# Altium project PCB_Project1.PrjPCB
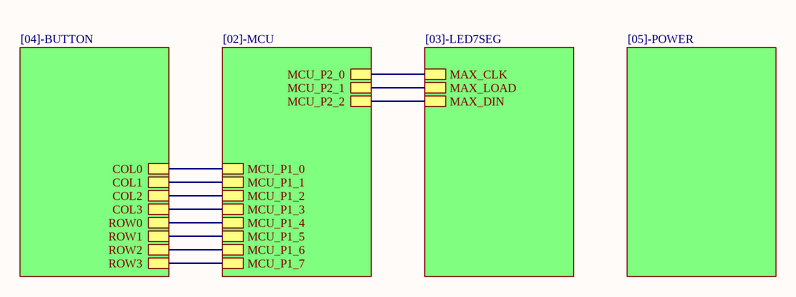
[diagram p0: Sheet1.SchDoc]
5 sheets, 31 parts. Net scope: hierarchical (ports join the sheet entries above them; power ports are global).
Board file: PCB1.PcbDoc
Sheets:
  Sheet1.SchDoc
     = [02]-MCU.SchDoc
    Designator = [04]-BUTTON.SchDoc
     = [05]-POWER.SchDoc
     = [03]-LED7SEG.SchDoc

## Sheet Sheet1.SchDoc
size A; Address1: chien nguyen

### Sub-sheets
Designator = [04]-BUTTON: ROW3, COL2, ROW0, ROW1, COL1, COL0, COL3, ROW2
? = [02]-MCU: MCU_P2_0, MCU_P2_1, MCU_P2_2, MCU_P1_0, MCU_P1_6, MCU_P1_7, MCU_P1_4, MCU_P1_5, MCU_P1_3, MCU_P1_2, MCU_P1_1
? = [05]-POWER: no entries
? = [03]-LED7SEG: MAX_CLK, MAX_DIN, MAX_LOAD

### Nets
NetIC1_1: sheet /MCU_P1_0, sheet Designator/COL0
NetIC1_2: sheet /MCU_P1_1, sheet Designator/COL1
NetIC1_3: sheet /MCU_P1_2, sheet Designator/COL2
NetIC1_4: sheet /MCU_P1_3, sheet Designator/COL3
NetIC1_5: sheet /MCU_P1_4, sheet Designator/ROW0
NetIC1_6: sheet /MCU_P1_5, sheet Designator/ROW1
NetIC1_7: sheet /MCU_P1_6, sheet Designator/ROW2
NetIC1_8: sheet /MCU_P1_7, sheet Designator/ROW3
NetIC1_21: sheet /MCU_P2_0, sheet /MAX_CLK
NetIC1_22: sheet /MCU_P2_1, sheet /MAX_LOAD
NetIC1_23: sheet /MCU_P2_2, sheet /MAX_DIN

## Sheet [02]-MCU.SchDoc
size A
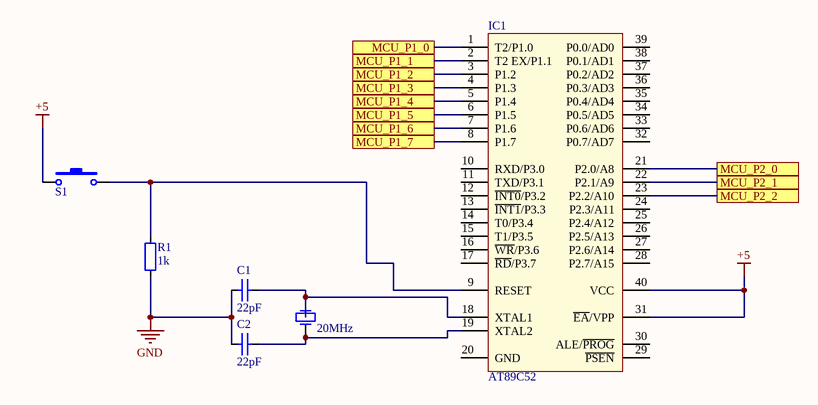
[diagram p1: [02]-MCU.SchDoc]

### Parts
C1  22pF  [CAP_0805]
C2  22pF  [CAP_0805]
IC1  AT89C52  [DIP40/W0.6]
R1  1k  [RES-SMD-0805]
S1  SW-SMD  [SW-SMD]  (value not drawn)
Y1  20MHz  [XTAL]

### Ports
MCU_P1_0, MCU_P1_1, MCU_P1_2, MCU_P1_3, MCU_P1_4, MCU_P1_5, MCU_P1_6, MCU_P1_7, MCU_P2_0, MCU_P2_1, MCU_P2_2

### Nets
+5: IC1.31(~{EA}/VPP) IC1.40(VCC) S1.1
GND: C1.1 C2.1 R1.1
NetC1_2: C1.2 IC1.18(XTAL1) Y1.2(OSC2)
NetC2_2: C2.2 IC1.19(XTAL2) Y1.1(OSC1)
NetIC1_1: IC1.1(T2/P1.0) ; port MCU_P1_0
NetIC1_2: IC1.2(T2_EX/P1.1) ; port MCU_P1_1
NetIC1_3: IC1.3(P1.2) ; port MCU_P1_2
NetIC1_4: IC1.4(P1.3) ; port MCU_P1_3
NetIC1_5: IC1.5(P1.4) ; port MCU_P1_4
NetIC1_6: IC1.6(P1.5) ; port MCU_P1_5
NetIC1_7: IC1.7(P1.6) ; port MCU_P1_6
NetIC1_8: IC1.8(P1.7) ; port MCU_P1_7
NetIC1_9: IC1.9(RESET) R1.2 S1.2
NetIC1_21: IC1.21(P2.0/A8) ; port MCU_P2_0
NetIC1_22: IC1.22(P2.1/A9) ; port MCU_P2_1
NetIC1_23: IC1.23(P2.2/A10) ; port MCU_P2_2

Not connected (* = marked no-connect by the designer): IC1 10(RXD/P3.0) 11(TXD/P3.1) 12(~{INT0}/P3.2) 13(~{INT1}/P3.3) 14(T0/P3.4) 15(T1/P3.5) 16(~{WR}/P3.6) 17(~{RD}/P3.7) 20(GND) 24(P2.3/A11) 25(P2.4/A12) 26(P2.5/A13) 27(P2.6/A14) 28(P2.7/A15) 29(~{PSEN}) 30(ALE/~{PROG}) 32(P0.7/AD7) 33(P0.6/AD6) 34(P0.5/AD5) 35(P0.4/AD4) 36(P0.3/AD3) 37(P0.2/AD2) 38(P0.1/AD1) 39(P0.0/AD0)

### Library data of the parts
C1 C2 = CapSMD: Capacitor; Value: 33p; Published: 8-Jun-2000; LatestRevisionDate: 17-Jul-2002; LatestRevisionNote: Re-released for DXP Platform.; PackageReference: RAD-0.3; Publisher: Altium Limited
IC1 = AT89C52: Atmel AT89C52, 8k Byte Flash Memory , 40 Pin; Value: AT89C52
R1 = Resistor - DIP: Value: R1/4W - 1K
S1 = SW-SMD: Switch; Published: 24-Mar-1999; LatestRevisionDate: 17-Jul-2002; LatestRevisionNote: Re-released for DXP Platform.; PackageReference: SPST-2; Publisher: Altium Limited
Y1 = XTAL: Crystal Oscillator; Published: 8-Jun-2000; LatestRevisionDate: 17-Jul-2002; LatestRevisionNote: Re-released for DXP Platform.; PackageReference: R38; Publisher: Altium Limited

## Sheet [04]-BUTTON.SchDoc
size A
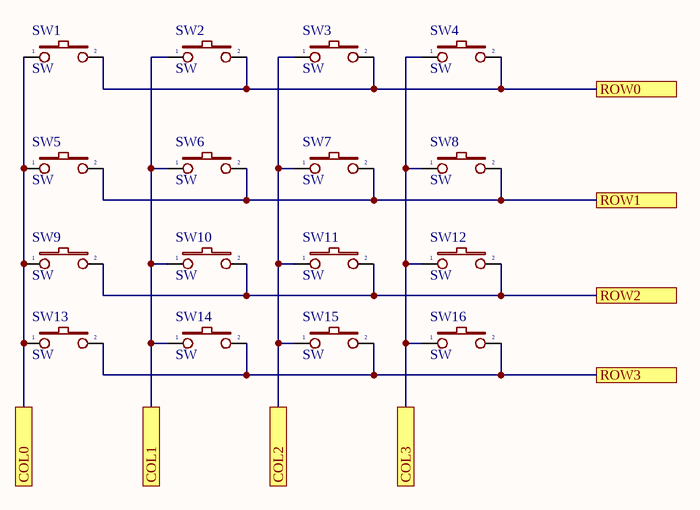
[diagram p2: [04]-BUTTON.SchDoc]

### Parts
SW1  SW  [SW-SMD]
SW2  SW  [SW-SMD]
SW3  SW  [SW-SMD]
SW4  SW  [SW-SMD]
SW5  SW  [SW-SMD]
SW6  SW  [SW-SMD]
SW7  SW  [SW-SMD]
SW8  SW  [SW-SMD]
SW9  SW  [SW-SMD]
SW10  SW  [SW-SMD]
SW11  SW  [SW-SMD]
SW12  SW  [SW-SMD]
SW13  SW  [SW-SMD]
SW14  SW  [SW-SMD]
SW15  SW  [SW-SMD]
SW16  SW  [SW-SMD]

### Ports
COL0, COL1, COL2, COL3, ROW0, ROW1, ROW2, ROW3

### Nets
NetIC1_1: SW1.1 SW5.1 SW9.1 SW13.1 ; port COL0
NetIC1_2: SW2.1 SW6.1 SW10.1 SW14.1 ; port COL1
NetIC1_3: SW3.1 SW7.1 SW11.1 SW15.1 ; port COL2
NetIC1_4: SW4.1 SW8.1 SW12.1 SW16.1 ; port COL3
NetIC1_5: SW1.2 SW2.2 SW3.2 SW4.2 ; port ROW0
NetIC1_6: SW5.2 SW6.2 SW7.2 SW8.2 ; port ROW1
NetIC1_7: SW9.2 SW10.2 SW11.2 SW12.2 ; port ROW2
NetIC1_8: SW13.2 SW14.2 SW15.2 SW16.2 ; port ROW3

### Library data of the parts
SW1-SW16 = SW2: Switch button 2 pin; Value: SW chip 2 pin

## Sheet [05]-POWER.SchDoc
size A
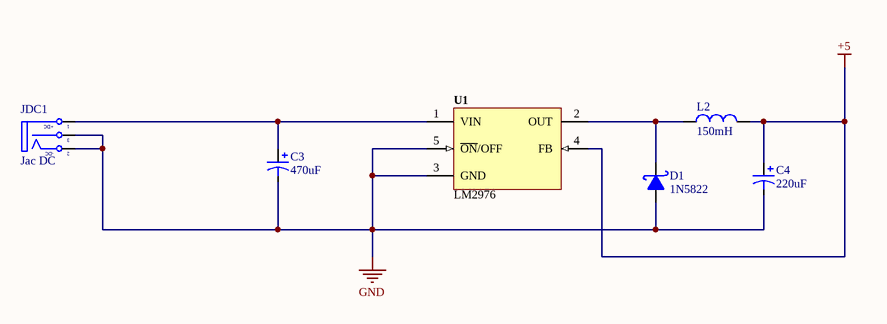
[diagram p3: [05]-POWER.SchDoc]

### Parts
C3  470uF  [C5mm]
C4  220uF  [C5mm]
D1  1N5822  [SMA]
JDC1  Jac DC  [DC-IN]
L2  150mH  [L-SMD-M-7.3x4.5]
U1  LM2976  [TO-263]

### Nets
+5: C4.1 L2.2 U1.4(FB)
GND: C3.2 C4.2 D1.1(A) JDC1.2(TN) JDC1.3(S) U1.3(GND) U1.5(~{ON}/OFF)
NetC3_1: C3.1 JDC1.1(T) U1.1(VIN)
NetD1_2: D1.2(K) L2.1 U1.2(OUT)

### Notes on the sheet
- (in symbol DCIN) +DC; -DC

### Library data of the parts
C3 C4 = Cap Pol: Polarized Capacitor (Axial); Published: 8-Jun-2000; LatestRevisionDate: 17-Jul-2002; LatestRevisionNote: Re-released for DXP Platform.; PackageReference: POLAR0.8; Publisher: Altium Limited
D1 = 1N5822: Schottky Rectifiers; Value: Diode c?m 1N5408
JDC1 = DCIN: Jac DC input; Value: Jac DC
L2 = Inductor: Value: 150 mH
U1 = LM2596: Max Input Voltage: 12 V; Max Output Current: 3 (6.0 peak) A; Max Output Voltage: mV; Category: IC-Power; Min Input Voltage: mV; Min Output Voltage: mV; Mounting Technology: Surface Mount; Status: Unreleased; Supply Voltage: mV; Temperature Range: -40 to +125 degC

## Sheet [03]-LED7SEG.SchDoc
size A
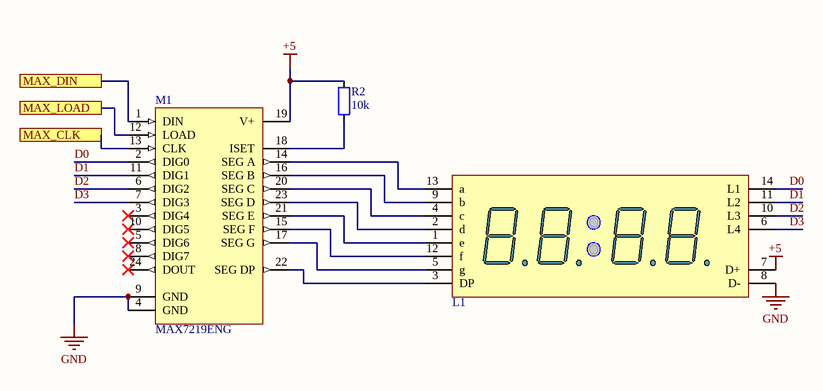
[diagram p4: [03]-LED7SEG.SchDoc]

### Parts
L1  Led 7 Seg 4 digit - Anode  [7SEGQ]  (value not drawn)
M1  MAX7219ENG  [SO24_L]
R2  10k  [RES_SMD_0805]

### Ports
MAX_CLK, MAX_DIN, MAX_LOAD

### Nets
+5: L1.7(D+) M1.19(V+) R2.2
GND: L1.8(D-) M1.4(GND) M1.9(GND)
D0: L1.14(L1) M1.2(DIG0)
D1: L1.11(L2) M1.11(DIG1)
D2: L1.10(L3) M1.6(DIG2)
D3: L1.6(L4) M1.7(DIG3)
NetIC1_21: M1.13(CLK) ; port MAX_CLK
NetIC1_22: M1.12(LOAD) ; port MAX_LOAD
NetIC1_23: M1.1(DIN) ; port MAX_DIN
NetL1_1: L1.1(e) M1.21(SEG_E)
NetL1_2: L1.2(d) M1.23(SEG_D)
NetL1_3: L1.3(DP) M1.22(SEG_DP)
NetL1_4: L1.4(c) M1.20(SEG_C)
NetL1_5: L1.5(g) M1.17(SEG_G)
NetL1_9: L1.9(b) M1.16(SEG_B)
NetL1_12: L1.12(f) M1.15(SEG_F)
NetL1_13: L1.13(a) M1.14(SEG_A)
NetM1_18: M1.18(ISET) R2.1

Not connected (* = marked no-connect by the designer): M1 3(DIG4)* 5(DIG6)* 8(DIG7)* 10(DIG5)* 24(DOUT)*

### Library data of the parts
L1 = LED7SEG-4DIGIT-A
M1 = MAX7219ENG: Serially Interfaced, 8-Digit LED Display Driver; Published: 16-Jan-2001; LatestRevisionDate: 29-May-2009; LatestRevisionNote: Component Body Added.; DatasheetVersion: Jul-1997; PackageVersion: 1997; PackageReference: NG24A; Publisher: Altium Limited; PackageDescription: DIP, 24-Pin, Row Spacing 7.62 mm, Pitch 2.54 mm; Code_JEDEC: MS-001-AF; ComponentLink1Description: Manufacturer Link; ComponentLink1URL: http://www.maxim-ic.com/; ComponentLink2Description: Datasheet; ComponentLink2URL: http://pdfserv.maxim-ic.com/en/ds/MAX7219-MAX7221.pdf
R2 = Resistor - DIP: Value: R1/4W - 1K

## Nets that join several sheets
+5: [02]-MCU (IC1.31 IC1.40 S1.1), [05]-POWER (C4.1 L2.2 U1.4), [03]-LED7SEG (L1.7 M1.19 R2.2)
GND: [02]-MCU (C1.1 C2.1 R1.1), [05]-POWER (7 pins), [03]-LED7SEG (L1.8 M1.4 M1.9)
NetIC1_1: [02]-MCU (IC1.1), [04]-BUTTON (SW1.1 SW5.1 SW9.1 SW13.1)
NetIC1_2: [02]-MCU (IC1.2), [04]-BUTTON (SW2.1 SW6.1 SW10.1 SW14.1)
NetIC1_3: [02]-MCU (IC1.3), [04]-BUTTON (SW3.1 SW7.1 SW11.1 SW15.1)
NetIC1_4: [02]-MCU (IC1.4), [04]-BUTTON (SW4.1 SW8.1 SW12.1 SW16.1)
NetIC1_5: [02]-MCU (IC1.5), [04]-BUTTON (SW1.2 SW2.2 SW3.2 SW4.2)
NetIC1_6: [02]-MCU (IC1.6), [04]-BUTTON (SW5.2 SW6.2 SW7.2 SW8.2)
NetIC1_7: [02]-MCU (IC1.7), [04]-BUTTON (SW9.2 SW10.2 SW11.2 SW12.2)
NetIC1_8: [02]-MCU (IC1.8), [04]-BUTTON (SW13.2 SW14.2 SW15.2 SW16.2)
NetIC1_21: [02]-MCU (IC1.21), [03]-LED7SEG (M1.13)
NetIC1_22: [02]-MCU (IC1.22), [03]-LED7SEG (M1.12)
NetIC1_23: [02]-MCU (IC1.23), [03]-LED7SEG (M1.1)